# Altium schematic sheet Mixer_coupler.SchDoc: Pounder
size 420 x 297 mm; Author: G.Kasprowicz; CompanyName: WUT ISE; DrawnBy: G.Kasprowicz; Organization: WUT ISE; Address1: PW ISE; Address2: Nowowiejska 15/19 00-665 Warsaw; Address3: gkasprow@gmail.com; DocumentNumber: 2; Revision: 2; SheetNumber: 2; SheetTotal: 7; ModifiedBy: -; CheckedDate: -; Title2: PGA, Mixer & filter; DivGrp: WUT ISE; Designer: G.Kasprowicz; ModifiedDate: -; ProjectName: Sensor Box
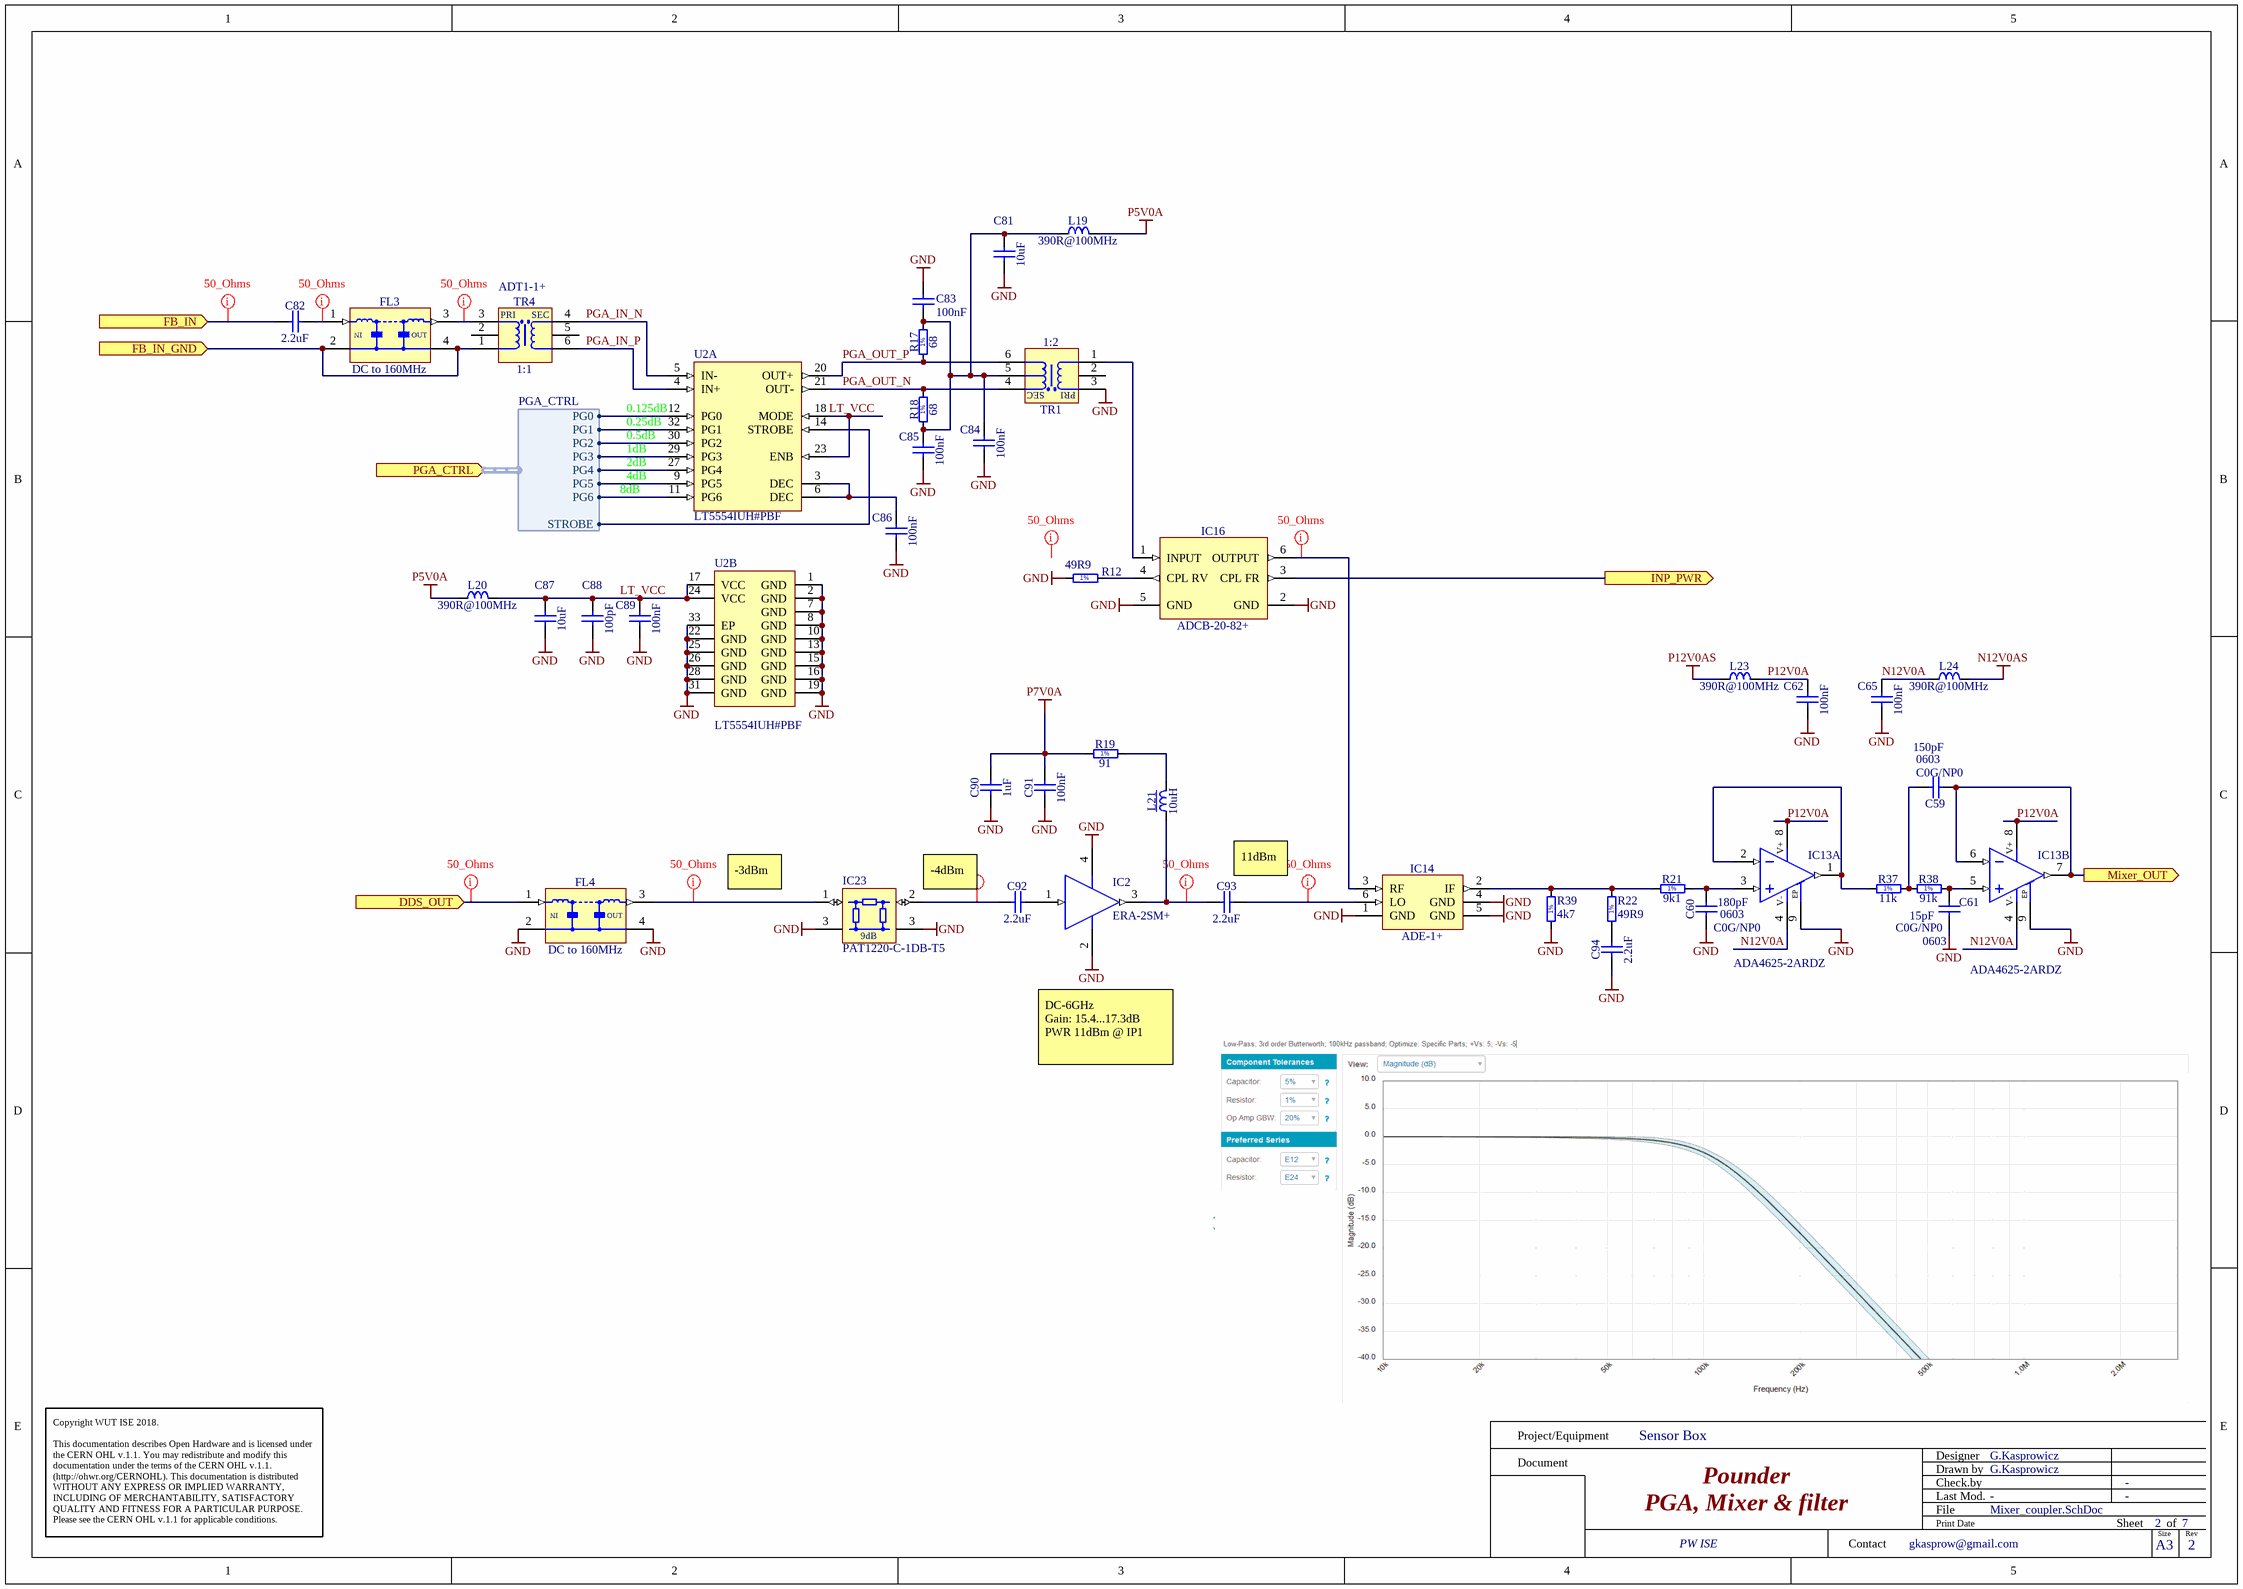
[diagram p0: Mixer_coupler.SchDoc]

## Parts
C59  150pF  TC: C0G/NP0  Case: 0603  [CAPC1608X87N]
C60  180pF  TC: C0G/NP0  Case: 0603  [CAPC1608X87N]
C61  15pF  TC: C0G/NP0  Case: 0603  [CAPC1608X87N]
C62  100nF  [CAPC1005X55N]
C65  100nF  [CAPC1005X55N]
C81  10uF  [CAPC1608X80N]
C82  2.2uF  [CAPC1005X55N]
C83  100nF  [CAPC1005X55N]
C84  100nF  [CAPC1005X55N]
C85  100nF  [CAPC1005X55N]
C86  100nF  [CAPC1005X55N]
C87  10uF  [CAPC1608X80N]
C88  100pF  [CAPC1005X55N]
C89  100nF  [CAPC1005X55N]
C90  1uF  [CAPC2012X140N]
C91  100nF  [CAPC1005X55N]
C92  2.2uF  [CAPC1005X55N]
C93  2.2uF  [CAPC1005X55N]
C94  2.2uF  [CAPC1005X55N]
FL3  DC to 160MHz  [FIL_MINI-CIRCUITS_FV1206]
FL4  DC to 160MHz  [FIL_MINI-CIRCUITS_FV1206]
IC2  ERA-2SM+  [MINI-CIRCUITS_WW107]
IC13  ADA4625-2ARDZ  [SOIC127P600X175-9N-S229]  (parts A,B of 2)
IC14  ADE-1+  [MACOM_SM-87]
IC16  ADCB-20-82+  [MINI-CIRCUITS_CD637]
IC23  PAT1220-C-1DB-T5  [SUSUMU_PAT1220]
L19  390R@100MHz  [INDC1608X95N]
L20  390R@100MHz  [INDC1608X95N]
L21  10uH  [IND_MURATA_LQH32C]
L23  390R@100MHz  [INDC1608X95N]
L24  390R@100MHz  [INDC1608X95N]
R12  49R9  [RESC1005X40N]
R17  68  [RESC1608X55N]
R18  68  [RESC1608X55N]
R19  91  [RESC3216X65N]
R21  9k1  [RESC1005X40N]
R22  49R9  [RESC1005X40N]
R37  11k  [RESC1608X55N]
R38  91k  [RESC1608X55N]
R39  4k7  [RESC1005X40N]
TR1  1:2  [XFMR_MINI-CIRCUITS_CD542]
TR4  1:1  Manufacturer Part Number: ADT1-1+  [XFMR_MINI-CIRCUITS_CD542]
U2  LT5554IUH#PBF  [LT-UH-32_N]  (parts A,B of 2)

## Ports
DDS_OUT (in), FB_IN (in), FB_IN_GND (in), INP_PWR (out), Mixer_OUT (out), PGA_CTRL (in, harness PGA_CTRL)

## Harnesses
PGA_CTRL: PG0, PG1, PG2, PG3, PG4, PG5, PG6, STROBE

## Nets
GND: C60.1 C61.1 C62.1 C65.1 C81.1 C83.1 C84.1 C85.1 C86.1 C87.1 C88.1 C89.1 C90.1 C91.1 C94.1 FL4.2(GND) FL4.4(GND) IC2.2(GND) IC2.4(GND) IC13.9(Exposed_Pad) IC14.1(GND) IC14.4(GND) IC14.5(GND) IC16.2(GND) IC16.5(GND) IC23.3(GND) R12.1 R39.1 TR1.3(PDOT) U2.1(GND) U2.2(GND) U2.7(GND) U2.8(GND) U2.10(GND) U2.13(GND) U2.15(GND) U2.16(GND) U2.19(GND) U2.22(GND) U2.25(GND) U2.26(GND) U2.28(GND) U2.31(GND) U2.33(EP)
N12V0AS: L24.2
P5V0A: L19.2 L20.1
P7V0A: C90.2 C91.2 R19.1
P12V0AS: L23.1
DDS_OUT: FL4.1(RFIN) ; port DDS_OUT
FB_IN: C82.1 ; port FB_IN
FB_IN_GND: FL3.2(GND) FL3.4(GND) TR4.1(P) ; port FB_IN_GND
INP_PWR: IC16.3(CPL_FR) ; port INP_PWR
LT_VCC: C87.2 C88.2 C89.2 L20.2 U2.17(VCC) U2.18(MODE) U2.23(ENB) U2.24(VCC)
Mixer_OUT: C59.1 IC13.6(IN-) IC13.7(OUT) ; port Mixer_OUT
N12V0A: C65.2 IC13.4(V-) L24.1
P12V0A: C62.2 IC13.8(V+) L23.2
PGA_IN_N: TR4.4(SDOT) U2.5(IN-)
PGA_IN_P: TR4.6(S) U2.4(IN+)
PGA_OUT_N: R18.2 TR1.4(S) U2.21(OUT-)
PGA_OUT_P: R17.1 TR1.6(SDOT) U2.20(OUT+)
NetC59_2: C59.2 R37.2 R38.1
NetC60_2: C60.2 IC13.3(IN+) R21.2
NetC61_2: C61.2 IC13.5(IN+) R38.2
NetC81_2: C81.2 C83.2 C84.2 C85.2 L19.1 R17.2 R18.1 TR1.5(SCT)
NetC82_2: C82.2 FL3.1(RFIN)
NetC86_2: C86.2 U2.3(DEC) U2.6(DEC)
NetC92_1: C92.1 IC23.2(OUT)
NetC92_2: C92.2 IC2.1(RF_IN)
NetC93_1: C93.1 IC2.3(RF_OUT) L21.1
NetC93_2: C93.2 IC14.6(LO)
NetC94_2: C94.2 R22.1
NetFL3_3: FL3.3(RFOUT) TR4.3(PDOT)
NetFL4_3: FL4.3(RFOUT) IC23.1(IN)
NetIC13_1: IC13.1(OUT) IC13.2(IN-) R37.1
NetIC14_2: IC14.2(IF) R21.1 R22.2 R39.2
NetIC14_3: IC14.3(RF) IC16.6(OUTPUT)
NetIC16_1: IC16.1(INPUT) TR1.1(P)
NetIC16_4: IC16.4(CPL_RV) R12.2
NetL21_2: L21.2 R19.2
NetU2_9: U2.9(PG5) ; port PGA_CTRL.PG5
NetU2_11: U2.11(PG6) ; port PGA_CTRL.PG6
NetU2_12: U2.12(PG0) ; port PGA_CTRL.PG0
NetU2_14: U2.14(STROBE) ; port PGA_CTRL.STROBE
NetU2_27: U2.27(PG4) ; port PGA_CTRL.PG4
NetU2_29: U2.29(PG3) ; port PGA_CTRL.PG3
NetU2_30: U2.30(PG2) ; port PGA_CTRL.PG2
NetU2_32: U2.32(PG1) ; port PGA_CTRL.PG1

Not connected (* = marked no-connect by the designer): TR1 2(NC); TR4 2(NC) 5(NC)

## Layout directives
net class 50_Ohms: (no net found under the mark), DDS_OUT, FB_IN, NetC82_2, NetC92_1, NetC93_1, NetC93_2, NetFL3_3, NetFL4_3, NetIC14_3

## Notes on the sheet
- (near U2) 0.125dB
- (near U2) 0.5dB
- (near U2) 1dB
- (near U2) 0.25dB
- 8dB
- (near U2) 4dB
- (near U2) 2dB
- -3dBm
- -4dBm
- (near C93) 11dBm
- DC-6GHz
  Gain: 15.4...17.3dB
  PWR 11dBm @ IP1
- Project/Equipment
- Document
- Designer
- Drawn by
- Check.by
- Copyright WUT ISE 2018.
  This documentation describes Open Hardware and is licensed under the CERN OHL v.1.1. You may redistribute and modify this documentation under the terms of the CERN OHL v.1.1. (http://ohwr.org/CERNOHL). This documentation is distributed WITHOUT ANY EXPRESS OR IMPLIED WARRANTY, INCLUDING OF MERCHANTABILITY, SATISFACTORY QUALITY AND FITNESS FOR A PARTICULAR PURPOSE. Please see the CERN OHL v.1.1 for applicable conditions.
- Contact
- File
- Last Mod.
- Print Date
- Sheet
- Size
- A3
- of
- Rev
- (in symbol ADA4898-2YRDZ, part A) EP
- (in symbol ADA4898-2YRDZ, part B) EP
- (in symbol FIL_MINI-CIRCUITS_LFCN-320) IN; OUT
- (in symbol R0402_4K7_1%_0.0625W_100PPM) 1%
- (in symbol R0402_9K1_1%_0.0625W_100PPM) 1%
- (in symbol R0402_49R9_1%_0.0625W_100PPM) 1%
- (in symbol R0603_11K_1%_0.1W_100PPM) 1%
- (in symbol R0603_68R_1%_0.1W_100PPM) 1%
- (in symbol R0603_91K_1%_0.1W_100PPM) 1%
- (in symbol R1206_91R_1%_0.25W_100PPM) 1%
- (in symbol RF_PAT1220-C-9DB-T5) 9dB
- (in symbol XFMR_MINI-CIRCUITS_ADT1-1+) PRI; SEC
- (in symbol XFMR_MINI-CIRCUITS_ADT2-1T-1P+) SEC; PRI

## Library data of the parts
C59 = CC0603_150PF_50V_1%_NP0: Non-polarised capacitor; Part Description: SMD Multilayer Chip Ceramic Capacitor; Manufacturer: GENERIC; Manufacturer1 Part Number: CC0603FRNPO9BN151; Voltage: 50V; Tolerance: ±1%; Part Number: CC0603_150PF_50V_1%_NP0; Component Kind: Standard; Component Type: Standard; Pin Count: 2; Value: 150pF; Status: None; Manufacturer Part Number: CC0603_150PF_50V_1%_NP0; Mounted: Yes; Socket: No; SMD: Yes; Sense: No; Manufacturer1 Example: PHYCOMP; Manufacturer1 ComponentHeight: 0.7mm; HelpURL: \\cern.ch\dfs\Applications\Altium\Datasheets\CC0805_NP0_PHYCOMP_16VTO50V.pdf; Author: CERN DEM MR; CreateDate: 17.02.2016; LatestRevisionDate: 17.02.2016
C60 = CC0603_180PF_50V_5%_NP0: Non-polarised capacitor; Part Description: SMD Multilayer Chip Ceramic Capacitor; Manufacturer: GENERIC; Manufacturer1 Part Number: 223886715181; Voltage: 50V; Tolerance: ±5%; Part Number: CC0603_180PF_50V_5%_NP0; Component Kind: Standard; Component Type: Standard; Pin Count: 2; Value: 180pF; Status: Preferred; Manufacturer Part Number: CC0603_180PF_50V_5%_NP0; Mounted: Yes; Socket: No; SMD: Yes; Sense: No; Manufacturer1 Example: PHYCOMP; Manufacturer1 ComponentHeight: 0.87mm; HelpURL: \\cern.ch\dfs\Applications\Altium\Datasheets\CC0603_NP0_PHYCOMP.pdf; Author: CERN DEM JLC; CreateDate: 03.12.2007; LatestRevisionDate: 03.12.2007
C61 = CC0603_15PF_50V_5%_NP0: Non-polarised capacitor; Part Description: SMD Multilayer Chip Ceramic Capacitor; Manufacturer: GENERIC; Manufacturer1 Part Number: 223886715159; Voltage: 50V; Tolerance: ±5%; Part Number: CC0603_15PF_50V_5%_NP0; Component Kind: Standard; Component Type: Standard; Pin Count: 2; Value: 15pF; Status: Preferred; Manufacturer Part Number: CC0603_15PF_50V_5%_NP0; Mounted: Yes; Socket: No; SMD: Yes; Sense: No; Manufacturer1 Example: PHYCOMP; Manufacturer1 ComponentHeight: 0.87mm; HelpURL: \\cern.ch\dfs\Applications\Altium\Datasheets\CC0603_NP0_PHYCOMP.pdf; Author: CERN DEM JLC; CreateDate: 03.12.2007; LatestRevisionDate: 03.12.2007
C62 C65 C83-C86 C89 = CC0402_100NF_16V_10%_X7R: Non-polarised capacitor; Part Description: SMD Multilayer Chip Ceramic Capacitor; Manufacturer: GENERIC; Manufacturer1 Part Number: GRM155R71C104KA88D; Voltage: 16V; TC: X7R; Tolerance: ±10%; Part Number: CC0402_100NF_16V_10%_X7R; Component Kind: Standard; Component Type: Standard; Pin Count: 2; Value: 100nF; Status: Not Recommended; Manufacturer Part Number: CC0402_100NF_16V_10%_X7R; Case: 0402; Mounted: Yes; Socket: No; SMD: Yes; Sense: No; Manufacturer1 Example: MURATA; Manufacturer1 ComponentHeight: 0.55mm; HelpURL: \\cern.ch\dfs\Applications\Altium\Datasheets\CC0402_X7R_MURATA_GRM.pdf; Author: CERN DEM JLC; CreateDate: 2013-12-05; LatestRevisionDate: 2007-12-03
C81 C87 = CC0603_10UF_16V_20%_X5R: Non-polarised capacitor; Part Description: SMD Multilayer Chip Ceramic Capacitor; Manufacturer: GENERIC; Manufacturer1 Part Number: GRM188R61C106MA73D; Voltage: 16V; TC: X5R; Tolerance: ±20%; Part Number: CC0603_10UF_16V_20%_X5R; Component Kind: Standard; Component Type: Standard; Pin Count: 2; Value: 10uF; Status: None; Manufacturer Part Number: CC0603_10UF_16V_20%_X5R; Case: 0603; Mounted: Yes; Socket: No; SMD: Yes; Sense: No; Manufacturer1 Example: MURATA; Manufacturer1 ComponentHeight: 0.8mm; HelpURL: \\cern.ch\dfs\Applications\Altium\Datasheets\CC0603_X5R_MURATA_GRM.pdf; Author: CERN DEM MR; CreateDate: 2016-03-02; LatestRevisionDate: 2016-03-02
C82 C92-C94 = CC0402_2.2UF_6.3V_10%_X5R: Non-polarised capacitor; Part Description: SMD Multilayer Chip Ceramic Capacitor; Manufacturer: GENERIC; Manufacturer1 Part Number: C1005X5R0J225K050BC; Voltage: 6.3V; TC: X5R; Tolerance: ±10%; Part Number: CC0402_2.2UF_6.3V_10%_X5R; Component Kind: Standard; Component Type: Standard; Pin Count: 2; Value: 2.2uF; Status: Preferred; Manufacturer Part Number: CC0402_2.2UF_6.3V_10%_X5R; Case: 0402; Mounted: Yes; Socket: No; SMD: Yes; Sense: No; Manufacturer1 Example: TDK; Manufacturer1 ComponentHeight: 0.55mm; HelpURL: \\cern.ch\dfs\Applications\Altium\Datasheets\CC0402_X5R_TDK_C.pdf; Author: CERN DEM JMW; CreateDate: 22.09.2015; LatestRevisionDate: 22.09.2015
C88 = CC0402_100PF_50V_5%_C0G: Non-polarised capacitor; Part Description: SMD Multilayer Chip Ceramic Capacitor; Manufacturer: GENERIC; Manufacturer1 Part Number: C0402C101J5GACTU; Voltage: 50V; TC: C0G/NP0; Tolerance: ±5%; Part Number: CC0402_100PF_50V_5%_C0G; Component Kind: Standard; Component Type: Standard; Pin Count: 2; Value: 100pF; Status: Preferred; Manufacturer Part Number: CC0402_100PF_50V_5%_C0G; Case: 0402; Mounted: Yes; Socket: No; SMD: Yes; Sense: No; Manufacturer1 Example: KEMET; Manufacturer1 ComponentHeight: 0.55mm; HelpURL: \\cern.ch\dfs\Applications\Altium\Datasheets\CC0805_C0G_KEMET_(Commercial Grade).pdf; Author: CERN DEM JLC; CreateDate: 2007-12-03; LatestRevisionDate: 2015-04-22
C90 = CC0805_1UF_35V_20%_X7R: Non-polarised capacitor; Part Description: SMD Multilayer Chip Ceramic Capacitor; Manufacturer: GENERIC; Manufacturer1 Part Number: GMK212B7105MG-T; Voltage: 35V; TC: X7R; Tolerance: ±20%; Part Number: CC0805_1UF_35V_20%_X7R; Component Kind: Standard; Component Type: Standard; Pin Count: 2; Value: 1uF; Status: Not Recommended; Manufacturer Part Number: CC0805_1UF_35V_20%_X7R; Case: 0805; Mounted: Yes; Socket: No; SMD: Yes; Sense: No; Manufacturer1 Example: TAIYO YUDEN; Manufacturer1 ComponentHeight: 1.35mm; HelpURL: \\cern.ch\dfs\Applications\Altium\Datasheets\CC0805_X7R_TAIYO-YUDEN_HIGH-VALUE.pdf; Author: CERN DEM JLC; CreateDate: 2011-06-22; LatestRevisionDate: 2011-06-22
C91 = CC0402_100NF_16V_10%_X5R: Non-polarised capacitor; Part Description: SMD Multilayer Chip Ceramic Capacitor; Manufacturer: GENERIC; Manufacturer1 Part Number: GRM155R61C104KA88D; Voltage: 16V; TC: X5R; Tolerance: ±10%; Part Number: CC0402_100NF_16V_10%_X5R; Component Kind: Standard; Component Type: Standard; Pin Count: 2; Value: 100nF; Status: None; Manufacturer Part Number: CC0402_100NF_16V_10%_X5R; Case: 0402; Mounted: Yes; Socket: No; SMD: Yes; Sense: No; Manufacturer1 Example: MURATA; Manufacturer1 ComponentHeight: 0.55mm; HelpURL: \\cern.ch\dfs\Applications\Altium\Datasheets\CC0402_X5R_MURATA_GRM.pdf; Author: CERN DEM JLC; CreateDate: 10.12.2013; LatestRevisionDate: 10.12.2013
FL3 FL4 = FIL_MINI-CIRCUITS_LFCN-320: 50 Ohm DC to 320MHz Low Pass Filter; Part Number: FIL_MINI-CIRCUITS_LFCN-160; Part Description: 50 Ohm Low Pass Filter; Manufacturer Part Number: LFCN-160; Component Kind: Standard; Component Type: Standard; Pin Count: 2; Value: DC to 160MHz; Status: None; Manufacturer: MINI-CIRCUITS; Mounted: Yes; Socket: No; SMD: Yes; Sense: No; ComponentHeight: 0.94mm; HelpURL: \\cern.ch\dfs\Applications\Altium\Datasheets\FIL_MINI-CIRCUITS_LFCN-3000+.pdf; Author: CERN DEM JLC; CreateDate: 2013-12-09; LatestRevisionDate: 2013-12-09
IC2 = ERA-2SM+: Monolithic Amplifier; Part Description: DC-6GHz Monolithic Amplifier; Manufacturer: MINI-CIRCUITS; PressFit: No; Bonding: No; Part Number: ERA-2SM+; Component Kind: Standard; Component Type: Standard; Device: ERA-2SM+; PackageDescription: MINI-CIRCUITS WW107 Case, Body 2.16mm Diameter X 1.52mm H; Manufacturer Part Number: ERA-2SM+; Pin Count: 4; Mounted: Yes; Socket: No; SMD: Yes; Sense: No; ComponentHeight: 1.52mm; Author: CERN DEM JLC; HelpURL: \\cern.ch\dfs\Applications\Altium\Datasheets\ERA-2SM+.pdf; ComponentLink1URL: \\cern.ch\dfs\Applications\Altium\Datasheets\ERA-2SM+_Package-Drawing.pdf; ComponentLink1Description: Package Drawing; CreateDate: 09.12.2013; LatestRevisionDate: 09.12.2013
IC13 = ADA4898-2YRDZ: Dual Operational Amplifier With Exposed Pad; Part Description: Double, High Voltage, Low Noise, Low Distortion, Unity-Gain Stable, High Speed Operational Amplifier; Manufacturer: ANALOG DEVICES; PressFit: No; Bonding: No; Part Number: ADA4625-2ARDZ; Component Kind: Standard; Component Type: Standard; Device: ADA4625-2ARDZ; PackageDescription: SOIC 8, Pitch 1.27mm - Body 4x5mm, (w/thermal tab 2.29mm X 2.29mm), IPC Medium Density; Manufacturer Part Number: ADA4625-2ARDZ; Pin Count: 9; Case: SOIC8; Mounted: Yes; Socket: No; SMD: Yes; Sense: No; ComponentHeight: 1.75mm; Author: CERN DEM MR; HelpURL: \\cern.ch\dfs\Applications\Altium\Datasheets\ADA4898-2YRDZ.pdf; CreateDate: 20.05.2016; LatestRevisionDate: 20.05.2016
IC14 = MAMX-007238-CM25MH: 5 to 2500 MHz E-Series Surface Mount Mixer; Manufacturer: MACOM; PressFit: No; Bonding: No; Part Number: ADE-1+; Component Kind: Standard; Component Type: Standard; Device: ADE-1+; PackageDescription: MACOM Case Style SM-87 - Body W 6.35 x L 8.20 H 4.85mm; Part Description: 5 to 2500 MHz E-Series Surface Mount Mixer; Manufacturer Part Number: ADE-1+; Pin Count: 6; Mounted: Yes; Socket: No; SMD: Yes; Sense: No; ComponentHeight: 4.85mm; Author: CERN DEM JLC; HelpURL: \\cern.ch\dfs\Applications\Altium\Datasheets\MAMX-007238-CM25MH.pdf; CreateDate: 08.02.2017; LatestRevisionDate: 08.02.2017
IC16 = ADPQ-2-250: 50Ω,   20dB Coupling,    1 to 800 MHz; Manufacturer: MINI-CIRCUITS; PressFit: No; Bonding: No; Part Number: ADCB-20-82+; Component Kind: Standard; Component Type: Standard; Device: ADCB-20-82+; PackageDescription: MINI-CIRCUITS CD636 Case, 2.54mm pitch; 6 pin, 5.59mm W X 7.87mm L; Part Description: 50Ω,   20dB Coupling,    1 to 800 MHz; Manufacturer Part Number: ADCB-20-82+; Pin Count: 6; Mounted: Yes; Socket: No; SMD: Yes; Sense: No; ComponentHeight: 5.23mm; Author: CERN DEM MR; HelpURL: \\cern.ch\dfs\Applications\Altium\Datasheets\ADPQ-2-250.pdf; CreateDate: 02.03.2017; LatestRevisionDate: 02.03.2017
IC23 = RF_PAT1220-C-9DB-T5: DC to 10GHz, 100mw, 50 Ohm, 9dB, Precision chip attenuator; Part Description: DC to 10GHz, 100mw, 50 Ohm, 9dB, Precision Chip 3dB Attenuator; Manufacturer: SUSUMU; PressFit: No; Sense Comment: Solder Paste Deposition Limitation; Bonding: No; Part Number: PAT1220-C-1DB-T5; Component Kind: Standard; Component Type: Standard; Device: PAT1220-C-1DB-T5; Footprint: SUSUMU_PAT1220-C-1DB-T5; PackageDescription: SUSUMU PAT1220, 4 Pin Attenuator, Sise 0402, L 1.00 x W 0.5 H 0.39mm; Status: Recommended; Manufacturer Part Number: PAT1220-C-1DB-T5; Pin Count: 4; Case: 0402; Mounted: Yes; Socket: No; SMD: Yes; Sense: Yes; ComponentHeight: 0.39mm; Author: GK; HelpURL: \\cern.ch\dfs\Applications\Altium\Datasheets\PAT0510S-C-9DB-T10.pdf; CreateDate: 09.03.2017; LatestRevisionDate: 02.05.2017
L19 L20 L23 L24 = IND0603_TDK_MPZ1608R391A: Inductor; Part Description: SMT Chip Bead for Power Line; Manufacturer: TDK; Power: 1.2A; Resistance: 0.12R; Tolerance: ±25%; Part Number: IND0603_TDK_MPZ1608R391A; Component Kind: Standard; Component Type: Standard; Pin Count: 2; Value: 390R@100MHz; Status: None; Manufacturer Part Number: MPZ1608R391A; Case: 0603; Mounted: Yes; Socket: No; SMD: Yes; Sense: No; ComponentHeight: 0.95mm; HelpURL: \\cern.ch\dfs\Applications\Altium\Datasheets\IND0603_TDK_MPZ1608.pdf; Author: CERN DEM JLC; CreateDate: 2009-12-02; LatestRevisionDate: 2009-12-02
L21 = IND_10UH_10%_MURATA_LQH32CN100K33L: Inductor With Core; Part Description: Chip Inductor (Chip Coil) for Choke Wire Wound Type; Manufacturer: MURATA; Power: 450mA; Resistance: 0.3R; Tolerance: ±10%; Part Number: IND_10UH_10%_MURATA_LQH32CN100K33L; Component Kind: Standard; Component Type: Standard; Pin Count: 2; Value: 10uH; Status: None; Manufacturer Part Number: LQH32CN100K33L; Mounted: Yes; Socket: No; SMD: Yes; Sense: No; ComponentHeight: 2.2mm; HelpURL: \\cern.ch\dfs\Applications\Altium\Datasheets\IND_MURATA_LQH32CN_33.pdf; Author: CERN DEM JLC; CreateDate: 06.04.2009; LatestRevisionDate: 04.07.2018
R12 R22 = R0402_49R9_1%_0.0625W_100PPM: Resistor - 1%; Part Description: General Purpose Thick Film Chip Resistor; Manufacturer: GENERIC; Manufacturer1 Part Number: 232270674999L or RC0402FR-0749R9L; TC: ±100ppm/°C; PressFit: No; Part Number: R0402_49R9_1%_0.0625W_100PPM; Component Kind: Standard; Component Type: Standard; Pin Count: 2; Value: 49R9; Status: Not Recommended; Power: 0.0625W; Tolerance: ±1%; Manufacturer Part Number: R0402_49R9_1%_0.0625W_100PPM; Case: 0402; Mounted: Yes; Sense: No; Socket: No; SMD: Yes; Manufacturer1 Example: YAGEO PHYCOMP; Manufacturer1 ComponentHeight: 0.4mm; HelpURL: \\cern.ch\dfs\Applications\Altium\Datasheets\R0402_Phycomp_RC0402.pdf; Author: CERN DEM JLC; CreateDate: 24.10.2012; LatestRevisionDate: 24.10.2012
R17 R18 = R0603_68R_1%_0.1W_100PPM: Resistor - 1%; Part Description: General Purpose Thick Film Chip Resistor; Manufacturer: GENERIC; Manufacturer1 Part Number: NRC06F68R0TRF; Power: 0.1W; TC: ±100ppm/°C; PressFit: No; Part Number: R0603_68R_1%_0.1W_100PPM; Component Kind: Standard; Component Type: Standard; Pin Count: 2; Value: 68; Status: Preferred; Tolerance: ±1%; Manufacturer Part Number: R0603_68R_1%_0.1W_100PPM; Case: 0603; Mounted: Yes; Sense: No; Socket: No; SMD: Yes; Manufacturer1 Example: NIC COMPONENT; Manufacturer1 ComponentHeight: 0.55mm; HelpURL: \\cern.ch\dfs\Applications\Altium\Datasheets\R0603_NIC_NRC.pdf; Author: CERN DEM JLC; CreateDate: 03.12.2007; LatestRevisionDate: 13.03.2008
R19 = R1206_91R_1%_0.25W_100PPM: Resistor - 1%; Part Description: General Purpose Thick Film Chip Resistor; Manufacturer: GENERIC; Manufacturer1 Part Number: NRC12F91R0TRF; Power: 0.25W; TC: ±100ppm/°C; PressFit: No; Part Number: R1206_91R_1%_0.25W_100PPM; Component Kind: Standard; Component Type: Standard; Pin Count: 2; Value: 91; Status: Preferred; Tolerance: ±1%; Manufacturer Part Number: R1206_91R_1%_0.25W_100PPM; Case: 1206; Mounted: Yes; Sense: No; Socket: No; SMD: Yes; Manufacturer1 Example: NIC COMPONENT; Manufacturer1 ComponentHeight: 0.65mm; HelpURL: \\cern.ch\dfs\Applications\Altium\Datasheets\R1206_NIC_NRC.pdf; Author: CERN DEM JLC; CreateDate: 03.12.2007; LatestRevisionDate: 13.03.2008
R21 = R0402_9K1_1%_0.0625W_100PPM: Resistor - 1%; Part Description: General Purpose Thick Film Chip Resistor; Manufacturer: GENERIC; Manufacturer1 Part Number: 232270679102L; TC: ±100ppm/°C; PressFit: No; Part Number: R0402_9K1_1%_0.0625W_100PPM; Component Kind: Standard; Component Type: Standard; Pin Count: 2; Value: 9k1; Status: Not Recommended; Power: 0.0625W; Tolerance: ±1%; Manufacturer Part Number: R0402_9K1_1%_0.0625W_100PPM; Case: 0402; Mounted: Yes; Sense: No; Socket: No; SMD: Yes; Manufacturer1 Example: YAGEO PHYCOMP; Manufacturer1 ComponentHeight: 0.4mm; HelpURL: \\cern.ch\dfs\Applications\Altium\Datasheets\R0402_Phycomp_RC0402.pdf; Author: CERN DEM JLC; CreateDate: 03.12.2007; LatestRevisionDate: 17.10.2012
R37 = R0603_11K_1%_0.1W_100PPM: Resistor - 1%; Part Description: General Purpose Thick Film Chip Resistor; Manufacturer: GENERIC; Manufacturer1 Part Number: CRCW060311K0FKEA; Power: 0.1W; TC: ±100ppm/°C; PressFit: No; Part Number: R0603_11K_1%_0.1W_100PPM; Component Kind: Standard; Component Type: Standard; Pin Count: 2; Value: 11k; Status: Preferred; Tolerance: ±1%; Manufacturer Part Number: R0603_11K_1%_0.1W_100PPM; Case: 0603; Mounted: Yes; Sense: No; Socket: No; SMD: Yes; Manufacturer1 Example: VISHAY; Manufacturer1 ComponentHeight: 0.55mm; HelpURL: \\cern.ch\dfs\Applications\Altium\Datasheets\R0603_VISHAY_CRCW e3.pdf; Author: CERN DEM JLC; CreateDate: 03.12.2007; LatestRevisionDate: 14.03.2018
R38 = R0603_91K_1%_0.1W_100PPM: Resistor - 1%; Part Description: General Purpose Thick Film Chip Resistor; Manufacturer: GENERIC; Manufacturer1 Part Number: NRC06F9102TRF; Power: 0.1W; TC: ±100ppm/°C; PressFit: No; Part Number: R0603_91K_1%_0.1W_100PPM; Component Kind: Standard; Component Type: Standard; Pin Count: 2; Value: 91k; Status: Preferred; Tolerance: ±1%; Manufacturer Part Number: R0603_91K_1%_0.1W_100PPM; Case: 0603; Mounted: Yes; Sense: No; Socket: No; SMD: Yes; Manufacturer1 Example: NIC COMPONENT; Manufacturer1 ComponentHeight: 0.55mm; HelpURL: \\cern.ch\dfs\Applications\Altium\Datasheets\R0603_NIC_NRC.pdf; Author: CERN DEM JLC; CreateDate: 03.12.2007; LatestRevisionDate: 13.03.2008
R39 = R0402_4K7_1%_0.0625W_100PPM: Resistor - 1%; Part Description: General Purpose Thick Film Chip Resistor; Manufacturer: GENERIC; Manufacturer1 Part Number: 232270674702L; TC: ±100ppm/°C; Part Number: R0402_4K7_1%_0.0625W_100PPM; Component Kind: Standard; Component Type: Standard; Pin Count: 2; Value: 4k7; Status: Not recommended; Power: 0.0625W; Tolerance: ±1%; Manufacturer Part Number: R0402_4K7_1%_0.0625W_100PPM; Case: 0402; Mounted: Yes; Sense: No; Socket: No; SMD: Yes; Manufacturer1 Example: YAGEO PHYCOMP; Manufacturer1 ComponentHeight: 0.4mm; HelpURL: \\cern.ch\dfs\Applications\Altium\Datasheets\R0402_Phycomp_RC0402.pdf; Author: CERN DEM JLC; CreateDate: 2007-12-03; LatestRevisionDate: 2012-10-17
TR1 = XFMR_MINI-CIRCUITS_ADT2-1T-1P+: 50 Ohms 0.4 To 450MHz RF Transformer; Part Number: XFMR_MINI-CIRCUITS_ADT2-1T+; Manufacturer Part Number: ADT2-1T+; Component Kind: Standard; Component Type: Standard; Pin Count: 6; Value: 1:2; Status: None; Part Description: 50 Ohms 0.4 To 450MHz RF Transformer; Manufacturer: MINI-CIRCUITS; Mounted: Yes; Socket: No; Sense: No; SMD: Yes; ComponentHeight: 2.84mm; HelpURL: \\cern.ch\dfs\Applications\Altium\Datasheets\XFMR_MINI-CIRCUITS_ADT2-1T-1P+.pdf; Author: CERN DEM MR; CreateDate: 06.09.2017; LatestRevisionDate: 06.09.2017
TR4 = XFMR_MINI-CIRCUITS_ADT1-1+: 50 Ohm 0.15 To 400MHz RF Transformers; Part Description: 50 Ohms 0.15 to 400 MHz RF Transformer; Part Number: XFMR_MINI-CIRCUITS_ADT1-1+; Component Kind: Standard; Component Type: Standard; Pin Count: 6; Value: 1:1; Status: None; Manufacturer: MINI-CIRCUITS; Mounted: Yes; Socket: No; Sense: No; SMD: Yes; ComponentHeight: 2.84mm; HelpURL: \\cern.ch\dfs\Applications\Altium\Datasheets\XFMR_MINI-CIRCUITS_ADT1-1+.pdf; Author: CERN DEM JLC; CreateDate: 01.09.2011; LatestRevisionDate: 01.09.2011
U2 = CMP-0359-03989-2: Single Channel, Broadband Ultra Low Distortion 7-Bit Digitally Controlled Variable Gain Amplifier, 1000 MHz Typical GBW, 4.75 to 5.25 V, 32-Pin QFN (UH-32), Industrial, Pb-Free; Linear Technology Part Number: LT5554; Manufacturer: Linear Technology; Is (mA) Typical: 200; GBW (MHz) Typical: 1000; Vs Max (V): 5.25; Channels (#): 1; Vs Min (V): 4.75; Type: DIFF; ComponentLink3URL: http://cds.linear.com/docs/en/packaging/QFN_32_05-08-1693.pdf; ComponentLink1URL: http://www.linear.com/; ComponentLink2URL: http://cds.linear.com/docs/en/datasheet/5554f.pdf; Code_JEDEC: MO-220; ComponentLink2Description: Datasheet; Mounting Technology: Surface Mount; PackageDescription: 32-Lead Plastic QFN, Body 5 x 5 mm, Pitch 0.5 mm; PartNumber: LT5554IUH#PBF; PackageVersion: Rev D; ComponentLink3Description: Package Specification; RoHS: Pb-Free; ComponentLink1Description: Manufacturer URL; RevisionNote: URLs updated; PackageReference: LT-UH-32